# Altium schematic sheet Power-2.SchDoc: =ProjectTitle (part 1 of 2)
size A3; Author: Jaime I. Chait; Organization: NWES LLC; Address1: 111 SW 5th Ave, STE 3150; Address2: Portland, OR 97204; SheetNumber: 3; SheetTotal: 19
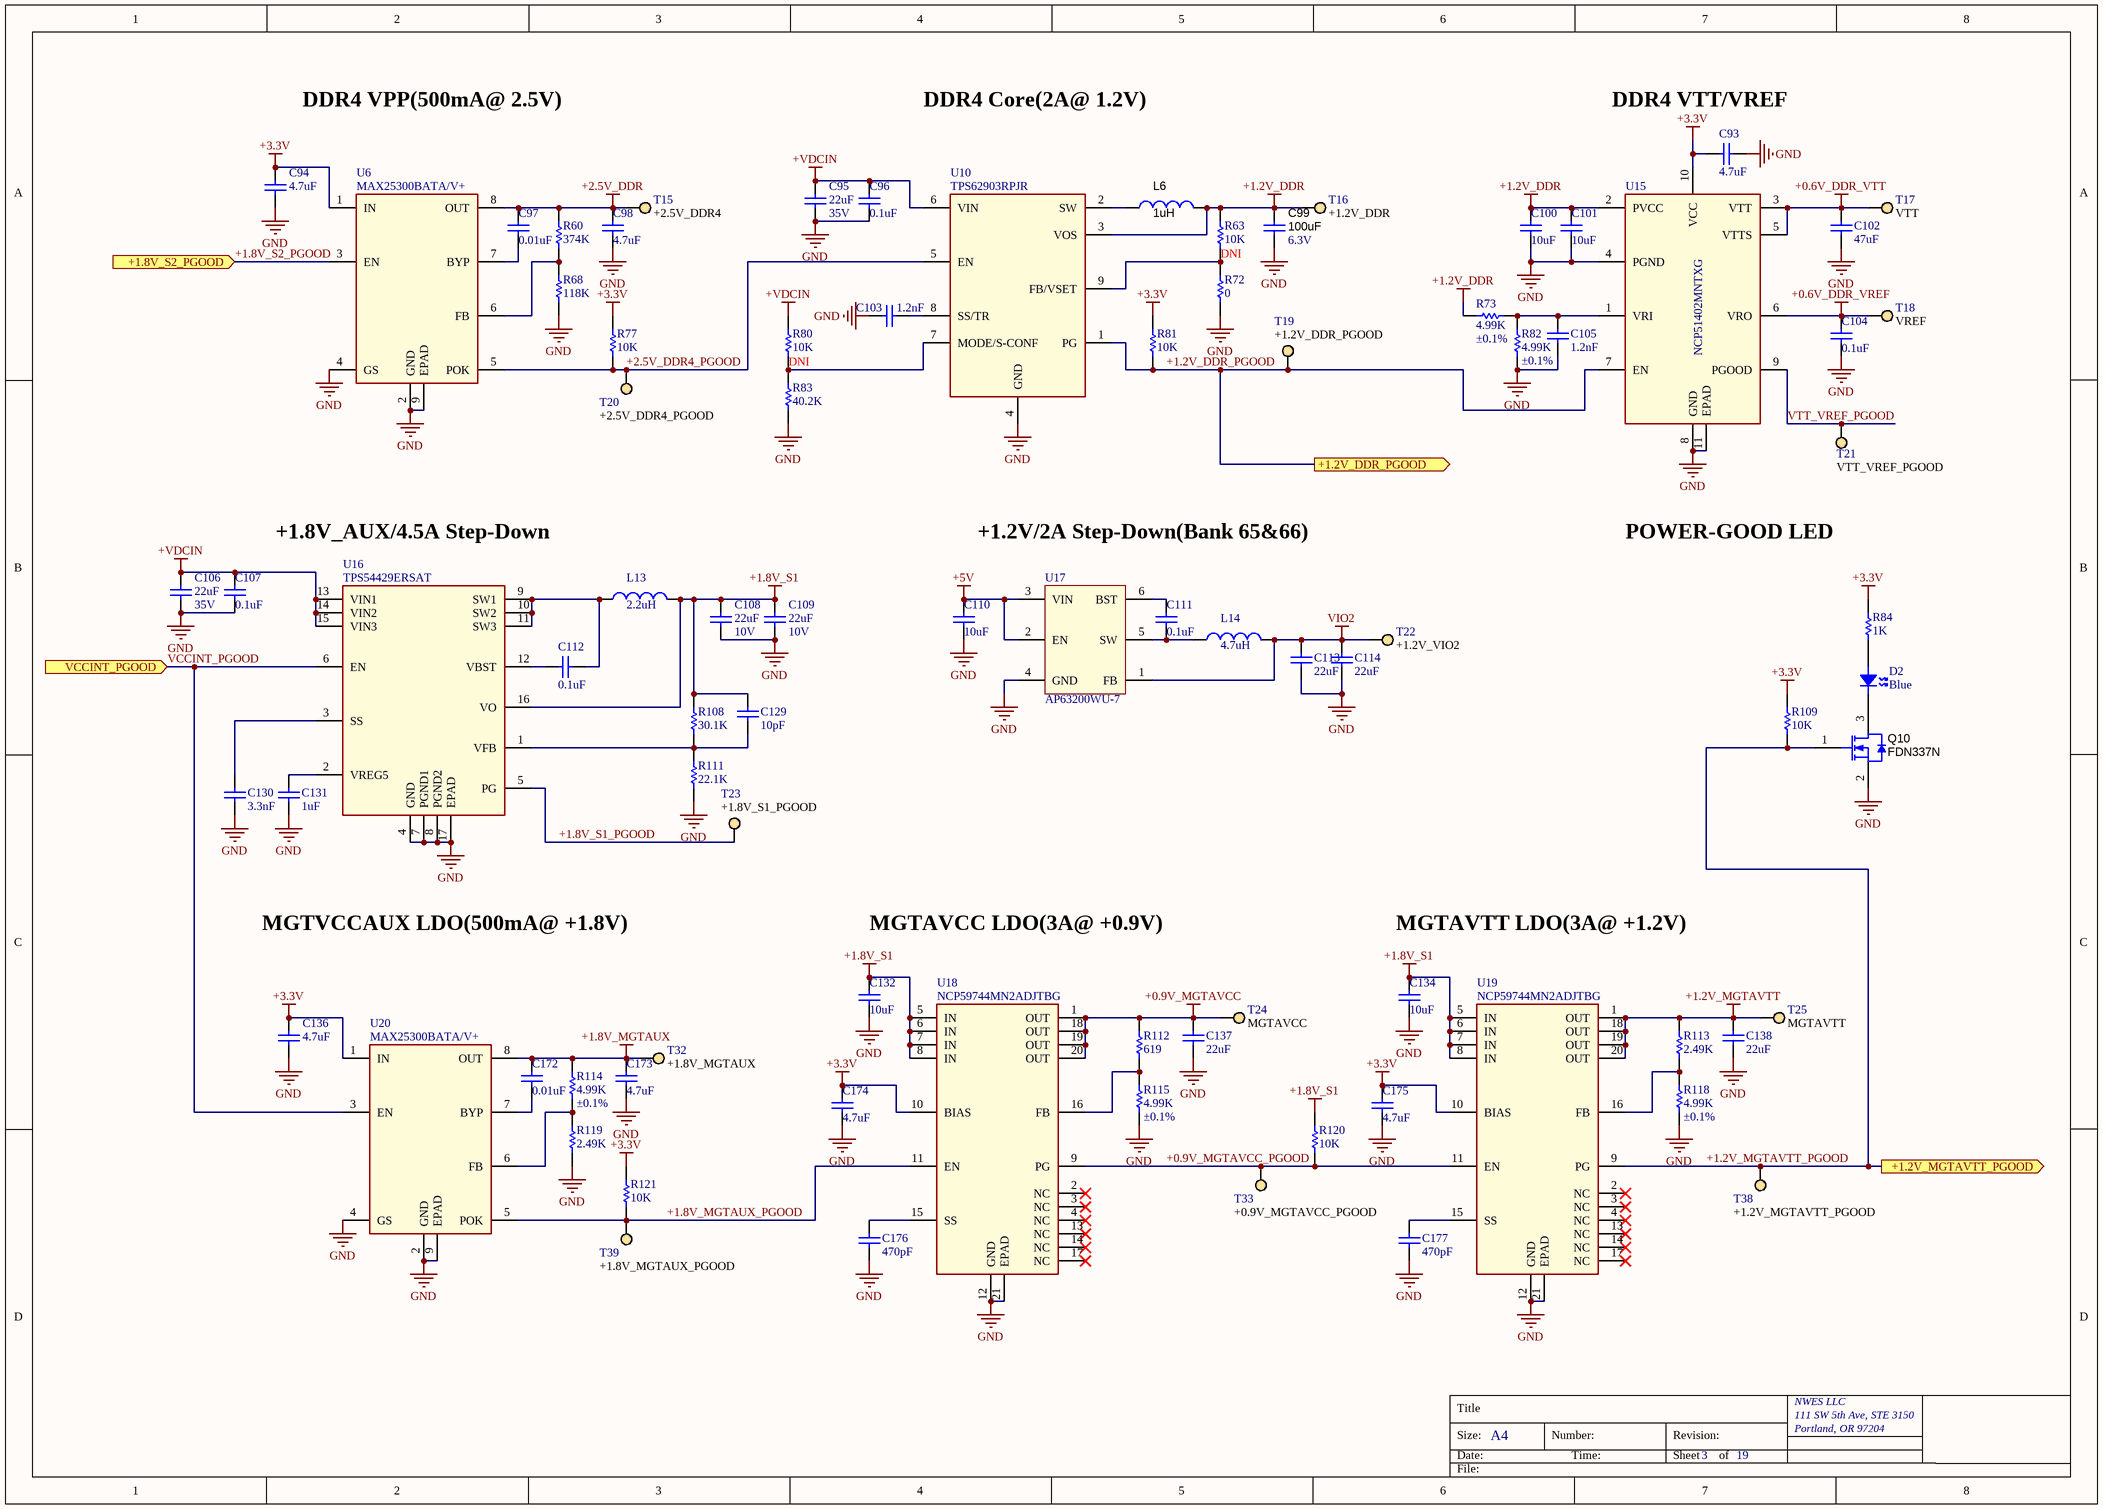
[diagram p0: Power-2.SchDoc]

## Parts
C93  4.7uF  [CAPC1005X65USR]
C94  4.7uF  [CAPC1005X65USR]
C95  22uF  Voltage Rating: 35V  [CAP-1206]
C96  0.1uF  [CAPC1005X55USR]
C97  0.01uF  [CAPC1005X55USR]
C98  4.7uF  [CAPC1005X65USR]
C99  100uF  Voltage Rating (DC): 6.3V  [CAPC3216X180N]
C100  10uF  [CAPC1005X90]
C101  10uF  [CAPC1005X90]
C102  47uF  [CAP-1206]
C103  1.2nF  [CAPC1005X55USR]
C104  0.1uF  [CAPC1005X55USR]
C105  1.2nF  [CAPC1005X55USR]
C106  22uF  Voltage Rating: 35V  [CAPC3216X180N]
C107  0.1uF  [CAPC1005X55USR]
C108  22uF  Voltage Rating: 10V  [CAPC1608X100N]
C109  22uF  Voltage Rating: 10V  [CAPC1608X100N]
C110  10uF  [CAPC1005X90]
C111  0.1uF  [CAPC1005X55USR]
C112  0.1uF  [CAPC1005X55USR]
C113  22uF  [CAPC1608X100N]
C114  22uF  [CAPC1608X100N]
C129  10pF  [CAPC1005X55USR]
C130  3.3nF  [CAPC1005X55USR]
C131  1uF  [CAPC1005X55USR]
C132  10uF  [CAPC1005X90]
C134  10uF  [CAPC1005X90]
C136  4.7uF  [CAPC1005X65USR]
C137  22uF  [CAPC1608X100N]
C138  22uF  [CAPC1608X100N]
C172  0.01uF  [CAPC1005X55USR]
C173  4.7uF  [CAPC1005X65USR]
C174  4.7uF  [CAPC1005X65USR]
C175  4.7uF  [CAPC1005X65USR]
C176  470pF  [CAPC1005X55USR]
C177  470pF  [CAPC1005X55USR]
D2  Blue  [LED_0603]
L6  1uH  [DFE252012P]
L13  2.2uH  [IND_SPM6530T-2R2M]
L14  4.7uH  [DFE252012P]
Q10  FDN337N  [SOT-23]
R60  374K  [RESC1005X40USR]
R63  10K  [RESC1005X40USR]
R68  118K  [RESC1005X40USR]
R72  0  [RESC1005X40USR]
R73  4.99K  Tolerance: ±0.1%  [RESC1005X40USR]
R77  10K  [RESC1005X40USR]
R80  10K  [RESC1005X40USR]
R81  10K  [RESC1005X40USR]
R82  4.99K  Tolerance: ±0.1%  [RESC1005X40USR]
R83  40.2K  [RESC1005X40USR]
R84  1K  [RESC1005X40USR]
R108  30.1K  [RESC1005X40USR]
R109  10K  [RESC1005X40USR]
R111  22.1K  [RESC1005X40USR]
R112  619  [RESC1005X40USR]
R113  2.49K  [RESC1005X40USR]
R114  4.99K  Tolerance: ±0.1%  [RESC1005X40USR]
R115  4.99K  Tolerance: ±0.1%  [RESC1005X40USR]
R118  4.99K  Tolerance: ±0.1%  [RESC1005X40USR]
R119  2.49K  [RESC1005X40USR]
R120  10K  [RESC1005X40USR]
R121  10K  [RESC1005X40USR]
T15  Parameter 1: +2.5V_DDR4  [TP_SM_1MM]  (hidden comment: TP_S)  (no BOM)
T16  Parameter 1: +1.2V_DDR  [TP_SM_1MM]  (hidden comment: TP_S)  (no BOM)
T17  Parameter 1: VTT  [TP_SM_1MM]  (hidden comment: TP_S)  (no BOM)
T18  Parameter 1: VREF  [TP_SM_1MM]  (hidden comment: TP_S)  (no BOM)
T19  Parameter 1: +1.2V_DDR_PGOOD  [TP_SM_1MM]  (hidden comment: TP_S)  (no BOM)
T20  Parameter 1: +2.5V_DDR4_PGOOD  [TP_SM_1MM]  (hidden comment: TP_S)  (no BOM)
T21  Parameter 1: VTT_VREF_PGOOD  [TP_SM_1MM]  (hidden comment: TP_S)  (no BOM)
T22  Parameter 1: +1.2V_VIO2  [TP_SM_1MM]  (hidden comment: TP_S)  (no BOM)
T23  Parameter 1: +1.8V_S1_PGOOD  [TP_SM_1MM]  (hidden comment: TP_S)  (no BOM)
T24  Parameter 1: MGTAVCC  [TP_SM_1MM]  (hidden comment: TP_S)  (no BOM)
T25  Parameter 1: MGTAVTT  [TP_SM_1MM]  (hidden comment: TP_S)  (no BOM)
T32  Parameter 1: +1.8V_MGTAUX  [TP_SM_1MM]  (hidden comment: TP_S)  (no BOM)
T33  Parameter 1: +0.9V_MGTAVCC_PGOOD  [TP_SM_1MM]  (hidden comment: TP_S)  (no BOM)
T38  Parameter 1: +1.2V_MGTAVTT_PGOOD  [TP_SM_1MM]  (hidden comment: TP_S)  (no BOM)
T39  Parameter 1: +1.8V_MGTAUX_PGOOD  [TP_SM_1MM]  (hidden comment: TP_S)  (no BOM)
U6  MAX25300BATA/V+  [8-TDFN-EP (2x2)]
U10  TPS62903RPJR  [9-VQFN-HR (1.5x2)]
U15  NCP51402MNTXG  [DFN10_3X3_ONS-M]
U16  TPS54429ERSAT  [16-QFN (4x4)]
U17  AP63200WU-7  [SOT95P280X100-6N]
U18  NCP59744MN2ADJTBG  [20-QFN (5x5)]
U19  NCP59744MN2ADJTBG  [20-QFN (5x5)]
U20  MAX25300BATA/V+  [8-TDFN-EP (2x2)]

## Ports
+1.2V_DDR_PGOOD (out), +1.2V_MGTAVTT_PGOOD (out), +1.8V_S2_PGOOD (in), VCCINT_PGOOD (in)

## Nets
+0.6V_DDR_VREF: C104.2 T18.1 U15.6(VRO)
+0.6V_DDR_VTT: C102.1 T17.1 U15.3(VTT) U15.5(VTTS)
+0.9V_MGTAVCC: C137.1 R112.2 T24.1 U18.1(OUT) U18.18(OUT) U18.19(OUT) U18.20(OUT)
+1.2V_DDR: C99.1 C100.2 C101.2 L6.2 R63.2 R73.2 T16.1 U10.3(VOS) U15.2(PVCC)
+1.2V_MGTAVTT: C138.1 R113.2 T25.1 U19.1(OUT) U19.18(OUT) U19.19(OUT) U19.20(OUT)
+1.8V_MGTAUX: C172.2 C173.2 R114.2 T32.1 U20.8(OUT)
+1.8V_S1: C108.1 C109.1 C129.2 C132.2 C134.2 L13.2 R108.2 R120.2 U16.16(VO) U18.5(IN) U18.6(IN) U18.7(IN) U18.8(IN) U19.5(IN) U19.6(IN) U19.7(IN) U19.8(IN)
+2.5V_DDR: C97.2 C98.2 R60.2 T15.1 U6.8(OUT)
+3.3V: C93.2 C94.2 C136.2 C174.2 C175.2 R77.2 R81.2 R84.2 R109.2 R121.2 U6.1(IN) U15.10(VCC) U18.10(BIAS) U19.10(BIAS) U20.1(IN)
+5V: C110.2 U17.2(EN) U17.3(VIN)
+VDCIN: C95.1 C96.2 C106.1 C107.2 R80.2 U10.6(VIN) U16.13(VIN1) U16.14(VIN2) U16.15(VIN3)
GND: C93.1 C94.1 C95.2 C96.1 C98.1 C99.2 C100.1 C101.1 C102.2 C103.1 C104.1 C105.1 C106.2 C107.1 C108.2 C109.2 C110.1 C113.2 C114.2 C130.1 C131.1 C132.1 C134.1 C136.1 C137.2 C138.2 C173.1 C174.1 C175.1 C176.1 C177.1 Q10.2(S) R68.1 R72.1 R82.1 R83.1 R111.1 R115.1 R118.1 R119.1 U6.2(GND) U6.4(GS) U6.9(EPAD) U10.4(GND) U15.4(PGND) U15.8(GND) U15.11(EPAD) U16.4(GND) U16.7(PGND1) U16.8(PGND2) U16.17(EPAD) U17.4(GND) U18.12(GND) U18.21(EPAD) U19.12(GND) U19.21(EPAD) U20.2(GND) U20.4(GS) U20.9(EPAD)
VIO2: C113.1 C114.1 L14.2 T22.1 U17.1(FB)
+0.9V_MGTAVCC_PGOOD: R120.1 T33.1 U18.9(PG) U19.11(EN)
+1.2V_DDR_PGOOD: R81.1 T19.1 U10.1(PG) U15.7(EN) ; port +1.2V_DDR_PGOOD
+1.2V_MGTAVTT_PGOOD: Q10.1(G) R109.1 T38.1 U19.9(PG) ; port +1.2V_MGTAVTT_PGOOD
+1.8V_MGTAUX_PGOOD: R121.1 T39.1 U18.11(EN) U20.5(POK)
+1.8V_S1_PGOOD: T23.1 U16.5(PG)
+1.8V_S2_PGOOD: U6.3(EN) ; port +1.8V_S2_PGOOD
+2.5V_DDR4_PGOOD: R77.1 T20.1 U6.5(POK) U10.5(EN)
VCCINT_PGOOD: U16.6(EN) U20.3(EN) ; port VCCINT_PGOOD
VTT_VREF_PGOOD: T21.1 U15.9(PGOOD)
NetC97_1: C97.1 U6.7(BYP)
NetC103_2: C103.2 U10.8(SS/TR)
NetC105_2: C105.2 R73.1 R82.2 U15.1(VRI)
NetC111_1: C111.1 L14.1 U17.5(SW)
NetC111_2: C111.2 U17.6(BST)
NetC112_1: C112.1 L13.1 U16.9(SW1) U16.10(SW2) U16.11(SW3)
NetC112_2: C112.2 U16.12(VBST)
NetC129_1: C129.1 R108.1 R111.2 U16.1(VFB)
NetC130_2: C130.2 U16.3(SS)
NetC131_2: C131.2 U16.2(VREG5)
NetC172_1: C172.1 U20.7(BYP)
NetC176_2: C176.2 U18.15(SS)
NetC177_2: C177.2 U19.15(SS)
NetD2_1: D2.1(A) R84.1
NetD2_2: D2.2(K) Q10.3(D)
NetL6_1: L6.1 U10.2(SW)
NetR60_1: R60.1 R68.2 U6.6(FB)
NetR63_1: R63.1 R72.2 U10.9(FB/VSET)
NetR80_1: R80.1 R83.2 U10.7(MODE/S-CONF)
NetR112_1: R112.1 R115.2 U18.16(FB)
NetR113_1: R113.1 R118.2 U19.16(FB)
NetR114_1: R114.1 R119.2 U20.6(FB)

Not connected (* = marked no-connect by the designer): U18 2(NC)* 3(NC)* 4(NC)* 13(NC)* 14(NC)* 17(NC)*; U19 2(NC)* 3(NC)* 4(NC)* 13(NC)* 14(NC)* 17(NC)*

## Notes on the sheet
- DDR4 VPP(500mA@ 2.5V)
- DDR4 Core(2A@ 1.2V)
- (near C93) DDR4 VTT/VREF
- (near R63) DNI
- (near R80) DNI
- +1.8V_AUX/4.5A Step-Down
- +1.2V/2A Step-Down(Bank 65&66)
- POWER-GOOD LED
- MGTVCCAUX LDO(500mA@ +1.8V)
- MGTAVCC LDO(3A@ +0.9V)
- MGTAVTT LDO(3A@ +1.2V)
- Title
- Size:
- Date:
- A4
- Number:
- Time:
- Revision:
- Sheet
- of
- File: